# Altium schematic sheet voidFRL.SchDoc
size 558 x 431 mm
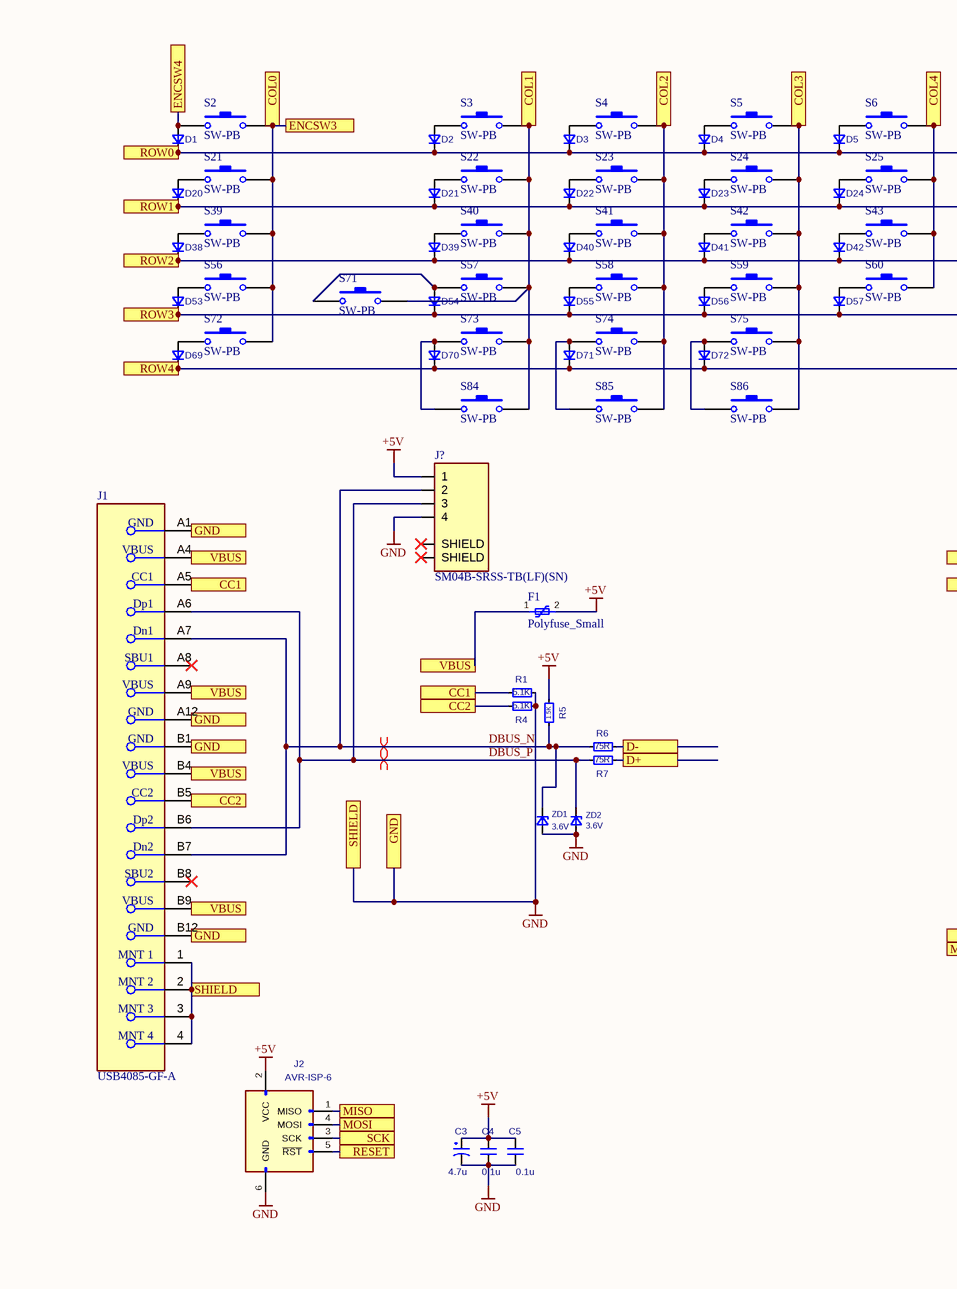
[diagram p0: voidFRL.SchDoc, left]
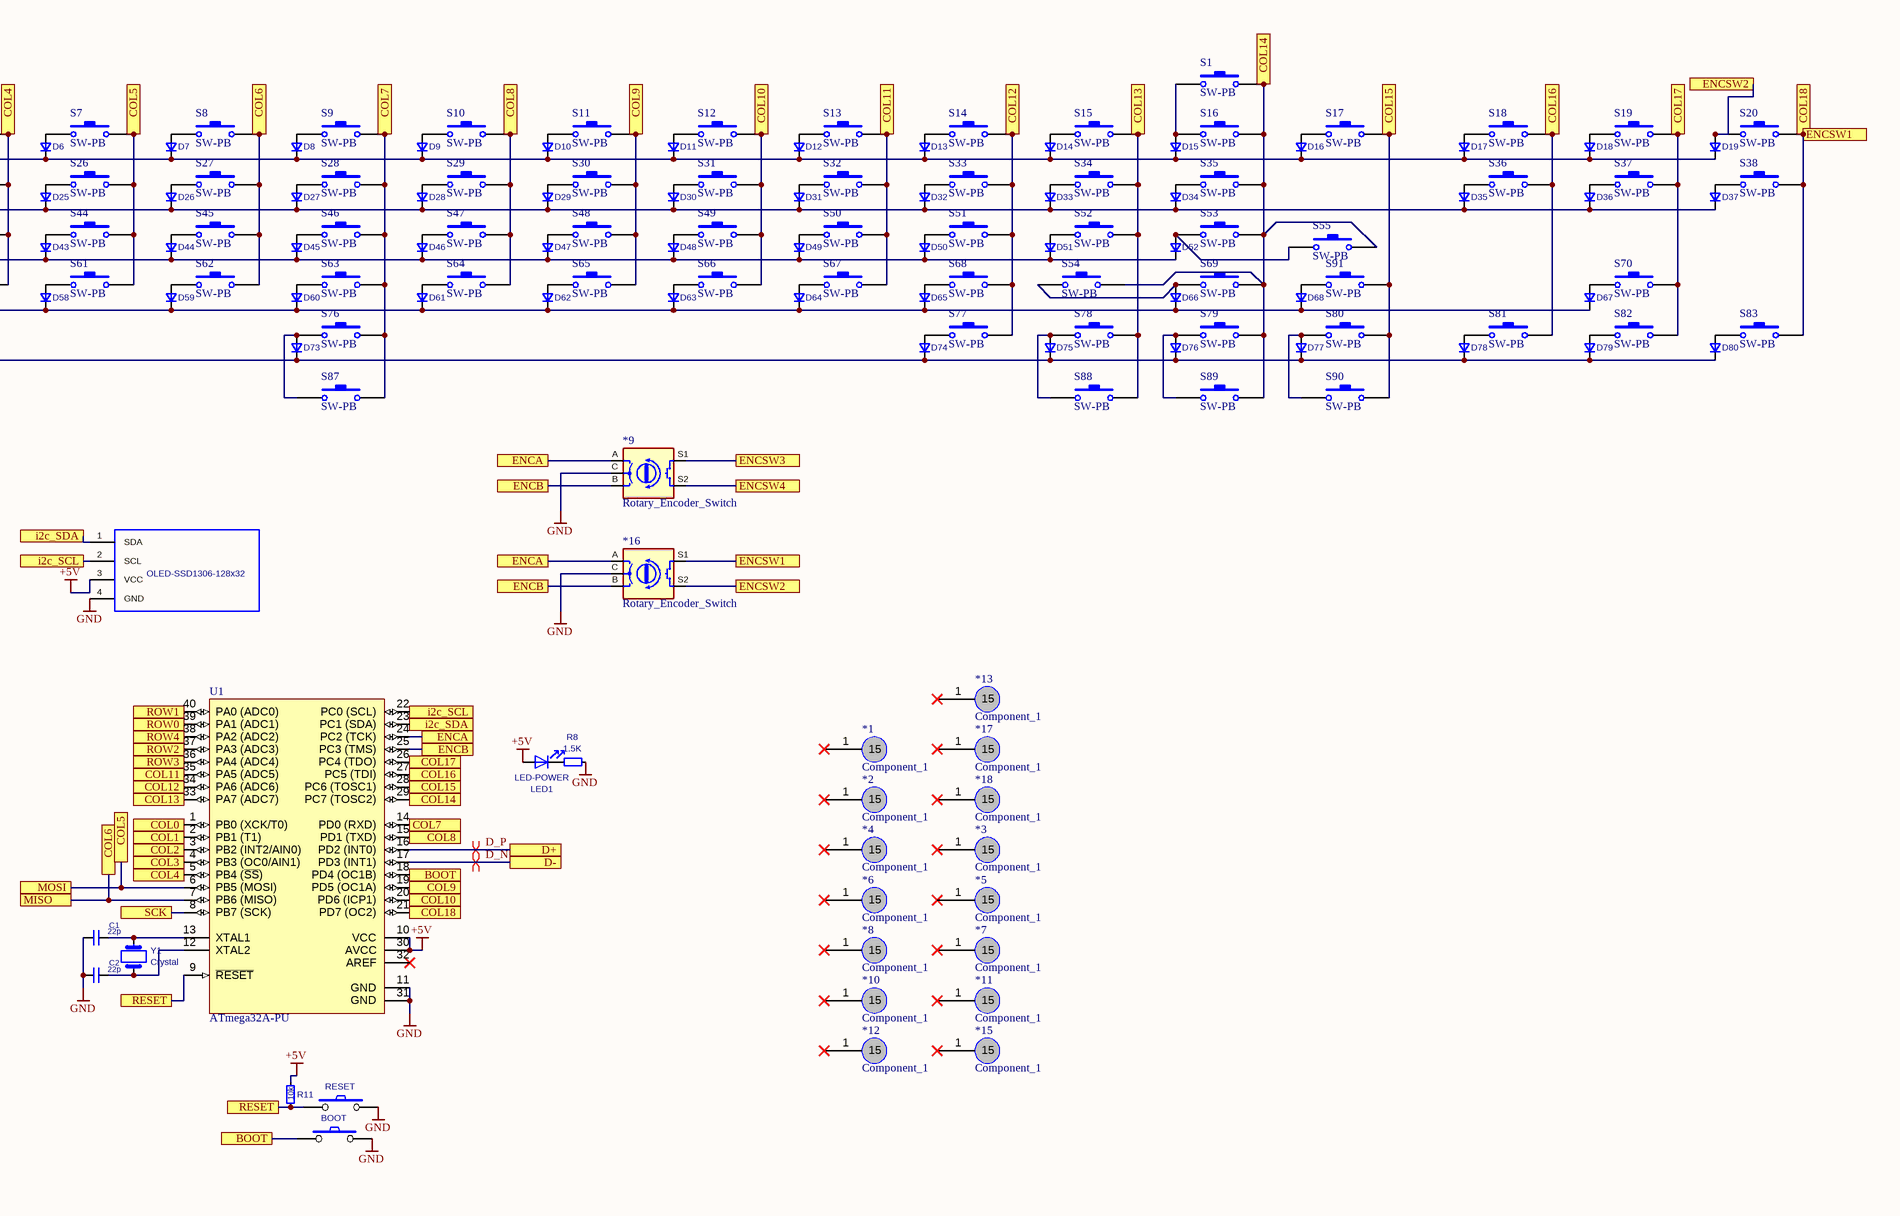
[diagram p1: voidFRL.SchDoc, right]

## Parts
*1  Component_1  [M2_Mounting_hole]
*2  Component_1  [M2_Mounting_hole]
*3  Component_1  [M2_Mounting_hole]
*4  Component_1  [M2_Mounting_hole]
*5  Component_1  [M2_Mounting_hole]
*6  Component_1  [M2_Mounting_hole]
*7  Component_1  [M2_Mounting_hole]
*8  Component_1  [M2_Mounting_hole]
*9  Rotary_Encoder_Switch  [RotaryEncoder_Alps_EC11E-Switch_Vertical_H20mm]
*10  Component_1  [M2_Mounting_hole]
*11  Component_1  [M2_Mounting_hole]
*12  Component_1  [M2_Mounting_hole]
*13  Component_1  [M2_Mounting_hole]
*15  Component_1  [M2_Mounting_hole]
*16  Rotary_Encoder_Switch  [RotaryEncoder_Alps_EC11E-Switch_Vertical_H20mm]
*17  Component_1  [M2_Mounting_hole]
*18  Component_1  [M2_Mounting_hole]
C1  22p  [C_Disc_D3.0mm_W1.6mm_P2.50mm]
C2  22p  [C_Disc_D3.0mm_W1.6mm_P2.50mm]
C3  4.7u  [CP_Radial_D4.0mm_P1.50mm]
C4  0.1u  [C_Disc_D4.3mm_W1.9mm_P5.00mm]
C5  0.1u  [C_Disc_D4.3mm_W1.9mm_P5.00mm]
D1  D_Small  [D_DO-35_SOD27_P5.08mm_Horizontal]  (value not drawn)
D2  D_Small  [D_DO-35_SOD27_P5.08mm_Horizontal]  (value not drawn)
D3  D_Small  [D_DO-35_SOD27_P5.08mm_Horizontal]  (value not drawn)
D4  D_Small  [D_DO-35_SOD27_P5.08mm_Horizontal]  (value not drawn)
D5  D_Small  [D_DO-35_SOD27_P5.08mm_Horizontal]  (value not drawn)
D6  D_Small  [D_DO-35_SOD27_P5.08mm_Horizontal]  (value not drawn)
D7  D_Small  [D_DO-35_SOD27_P5.08mm_Horizontal]  (value not drawn)
D8  D_Small  [D_DO-35_SOD27_P5.08mm_Horizontal]  (value not drawn)
D9  D_Small  [D_DO-35_SOD27_P5.08mm_Horizontal]  (value not drawn)
D10  D_Small  [D_DO-35_SOD27_P5.08mm_Horizontal]  (value not drawn)
D11  D_Small  [D_DO-35_SOD27_P5.08mm_Horizontal]  (value not drawn)
D12  D_Small  [D_DO-35_SOD27_P5.08mm_Horizontal]  (value not drawn)
D13  D_Small  [D_DO-35_SOD27_P5.08mm_Horizontal]  (value not drawn)
D14  D_Small  [D_DO-35_SOD27_P5.08mm_Horizontal]  (value not drawn)
D15  D_Small  [D_DO-35_SOD27_P5.08mm_Horizontal]  (value not drawn)
D16  D_Small  [D_DO-35_SOD27_P5.08mm_Horizontal]  (value not drawn)
D17  D_Small  [D_DO-35_SOD27_P5.08mm_Horizontal]  (value not drawn)
D18  D_Small  [D_DO-35_SOD27_P5.08mm_Horizontal]  (value not drawn)
D19  D_Small  [D_DO-35_SOD27_P5.08mm_Horizontal]  (value not drawn)
D20  D_Small  [D_DO-35_SOD27_P5.08mm_Horizontal]  (value not drawn)
D21  D_Small  [D_DO-35_SOD27_P5.08mm_Horizontal]  (value not drawn)
D22  D_Small  [D_DO-35_SOD27_P5.08mm_Horizontal]  (value not drawn)
D23  D_Small  [D_DO-35_SOD27_P5.08mm_Horizontal]  (value not drawn)
D24  D_Small  [D_DO-35_SOD27_P5.08mm_Horizontal]  (value not drawn)
D25  D_Small  [D_DO-35_SOD27_P5.08mm_Horizontal]  (value not drawn)
D26  D_Small  [D_DO-35_SOD27_P5.08mm_Horizontal]  (value not drawn)
D27  D_Small  [D_DO-35_SOD27_P5.08mm_Horizontal]  (value not drawn)
D28  D_Small  [D_DO-35_SOD27_P5.08mm_Horizontal]  (value not drawn)
D29  D_Small  [D_DO-35_SOD27_P5.08mm_Horizontal]  (value not drawn)
D30  D_Small  [D_DO-35_SOD27_P5.08mm_Horizontal]  (value not drawn)
D31  D_Small  [D_DO-35_SOD27_P5.08mm_Horizontal]  (value not drawn)
D32  D_Small  [D_DO-35_SOD27_P5.08mm_Horizontal]  (value not drawn)
D33  D_Small  [D_DO-35_SOD27_P5.08mm_Horizontal]  (value not drawn)
D34  D_Small  [D_DO-35_SOD27_P5.08mm_Horizontal]  (value not drawn)
D35  D_Small  [D_DO-35_SOD27_P5.08mm_Horizontal]  (value not drawn)
D36  D_Small  [D_DO-35_SOD27_P5.08mm_Horizontal]  (value not drawn)
D37  D_Small  [D_DO-35_SOD27_P5.08mm_Horizontal]  (value not drawn)
D38  D_Small  [D_DO-35_SOD27_P5.08mm_Horizontal]  (value not drawn)
D39  D_Small  [D_DO-35_SOD27_P5.08mm_Horizontal]  (value not drawn)
D40  D_Small  [D_DO-35_SOD27_P5.08mm_Horizontal]  (value not drawn)
D41  D_Small  [D_DO-35_SOD27_P5.08mm_Horizontal]  (value not drawn)
D42  D_Small  [D_DO-35_SOD27_P5.08mm_Horizontal]  (value not drawn)
D43  D_Small  [D_DO-35_SOD27_P5.08mm_Horizontal]  (value not drawn)
D44  D_Small  [D_DO-35_SOD27_P5.08mm_Horizontal]  (value not drawn)
D45  D_Small  [D_DO-35_SOD27_P5.08mm_Horizontal]  (value not drawn)
D46  D_Small  [D_DO-35_SOD27_P5.08mm_Horizontal]  (value not drawn)
D47  D_Small  [D_DO-35_SOD27_P5.08mm_Horizontal]  (value not drawn)
D48  D_Small  [D_DO-35_SOD27_P5.08mm_Horizontal]  (value not drawn)
D49  D_Small  [D_DO-35_SOD27_P5.08mm_Horizontal]  (value not drawn)
D50  D_Small  [D_DO-35_SOD27_P5.08mm_Horizontal]  (value not drawn)
D51  D_Small  [D_DO-35_SOD27_P5.08mm_Horizontal]  (value not drawn)
D52  D_Small  [D_DO-35_SOD27_P5.08mm_Horizontal]  (value not drawn)
D53  D_Small  [D_DO-35_SOD27_P5.08mm_Horizontal]  (value not drawn)
D54  D_Small  [D_DO-35_SOD27_P5.08mm_Horizontal]  (value not drawn)
D55  D_Small  [D_DO-35_SOD27_P5.08mm_Horizontal]  (value not drawn)
D56  D_Small  [D_DO-35_SOD27_P5.08mm_Horizontal]  (value not drawn)
D57  D_Small  [D_DO-35_SOD27_P5.08mm_Horizontal]  (value not drawn)
D58  D_Small  [D_DO-35_SOD27_P5.08mm_Horizontal]  (value not drawn)
D59  D_Small  [D_DO-35_SOD27_P5.08mm_Horizontal]  (value not drawn)
D60  D_Small  [D_DO-35_SOD27_P5.08mm_Horizontal]  (value not drawn)
D61  D_Small  [D_DO-35_SOD27_P5.08mm_Horizontal]  (value not drawn)
D62  D_Small  [D_DO-35_SOD27_P5.08mm_Horizontal]  (value not drawn)
D63  D_Small  [D_DO-35_SOD27_P5.08mm_Horizontal]  (value not drawn)
D64  D_Small  [D_DO-35_SOD27_P5.08mm_Horizontal]  (value not drawn)
D65  D_Small  [D_DO-35_SOD27_P5.08mm_Horizontal]  (value not drawn)
D66  D_Small  [D_DO-35_SOD27_P5.08mm_Horizontal]  (value not drawn)
D67  D_Small  [D_DO-35_SOD27_P5.08mm_Horizontal]  (value not drawn)
D68  D_Small  [D_DO-35_SOD27_P5.08mm_Horizontal]  (value not drawn)
D69  D_Small  [D_DO-35_SOD27_P5.08mm_Horizontal]  (value not drawn)
D70  D_Small  [D_DO-35_SOD27_P5.08mm_Horizontal]  (value not drawn)
D71  D_Small  [D_DO-35_SOD27_P5.08mm_Horizontal]  (value not drawn)
D72  D_Small  [D_DO-35_SOD27_P5.08mm_Horizontal]  (value not drawn)
D73  D_Small  [D_DO-35_SOD27_P5.08mm_Horizontal]  (value not drawn)
D74  D_Small  [D_DO-35_SOD27_P5.08mm_Horizontal]  (value not drawn)
D75  D_Small  [D_DO-35_SOD27_P5.08mm_Horizontal]  (value not drawn)
D76  D_Small  [D_DO-35_SOD27_P5.08mm_Horizontal]  (value not drawn)
D77  D_Small  [D_DO-35_SOD27_P5.08mm_Horizontal]  (value not drawn)
D78  D_Small  [D_DO-35_SOD27_P5.08mm_Horizontal]  (value not drawn)
D79  D_Small  [D_DO-35_SOD27_P5.08mm_Horizontal]  (value not drawn)
D80  D_Small  [D_DO-35_SOD27_P5.08mm_Horizontal]  (value not drawn)
F1  Polyfuse_Small  [polyfuse_5.1mm]
J1  USB4085-GF-A  [FP-USB4085-GF-A-MFG]
J2  AVR-ISP-6  [AVR_ICSP_3x2]
J?  SM04B-SRSS-TB(LF)(SN)  [JST_SM04B-SRSS-TB(LF)(SN)]
LED1  value LED-POWER  [LED_D3.0mm]  (hidden comment: LED-CPSLK)
OLED-1  OLED-SSD1306-128x32  [ssd1306 128x32 oled]
R1  5.1K  [R_Axial_DIN0204_L3.6mm_D1.6mm_P7.62mm_Horizontal]
R4  5.1K  [R_Axial_DIN0204_L3.6mm_D1.6mm_P7.62mm_Horizontal]
R5  1.5K  [R_Axial_DIN0204_L3.6mm_D1.6mm_P7.62mm_Horizontal]
R6  75R  [R_Axial_DIN0204_L3.6mm_D1.6mm_P7.62mm_Horizontal]
R7  75R  [R_Axial_DIN0204_L3.6mm_D1.6mm_P7.62mm_Horizontal]
R8  1.5K  [R_Axial_DIN0204_L3.6mm_D1.6mm_P7.62mm_Horizontal]
R11  10k  [R_Axial_DIN0204_L3.6mm_D1.6mm_P7.62mm_Horizontal]
RESET1  RESET  [SW_PUSH_6mm]
S1  SW-PB  [MX-switch - backspace]
S2  SW-PB  [MX-switch]
S3  SW-PB  [MX-switch]
S4  SW-PB  [MX-switch]
S5  SW-PB  [MX-switch]
S6  SW-PB  [MX-switch]
S7  SW-PB  [MX-switch]
S8  SW-PB  [MX-switch]
S9  SW-PB  [MX-switch]
S10  SW-PB  [MX-switch]
S11  SW-PB  [MX-switch]
S12  SW-PB  [MX-switch]
S13  SW-PB  [MX-switch]
S14  SW-PB  [MX-switch]
S15  SW-PB  [MX-switch]
S16  SW-PB  [MX-switch]
S17  SW-PB  [MX-switch]
S18  SW-PB  [MX-switch]
S19  SW-PB  [MX-switch]
S20  SW-PB  [MX-switch]
S21  SW-PB  [MX-switch]
S22  SW-PB  [MX-switch]
S23  SW-PB  [MX-switch]
S24  SW-PB  [MX-switch]
S25  SW-PB  [MX-switch]
S26  SW-PB  [MX-switch]
S27  SW-PB  [MX-switch]
S28  SW-PB  [MX-switch]
S29  SW-PB  [MX-switch]
S30  SW-PB  [MX-switch]
S31  SW-PB  [MX-switch]
S32  SW-PB  [MX-switch]
S33  SW-PB  [MX-switch]
S34  SW-PB  [MX-switch]
S35  SW-PB  [MX-switch]
S36  SW-PB  [MX-switch]
S37  SW-PB  [MX-switch]
S38  SW-PB  [MX-switch]
S39  SW-PB  [MX-switch]
S40  SW-PB  [MX-switch - CAPS]
S41  SW-PB  [MX-switch]
S42  SW-PB  [MX-switch]
S43  SW-PB  [MX-switch]
S44  SW-PB  [MX-switch]
S45  SW-PB  [MX-switch]
S46  SW-PB  [MX-switch]
S47  SW-PB  [MX-switch]
S48  SW-PB  [MX-switch]
S49  SW-PB  [MX-switch]
S50  SW-PB  [MX-switch]
S51  SW-PB  [MX-switch]
S52  SW-PB  [MX-switch]
S53  SW-PB  [MX-switch - ENTER_ANSI - ROTATED STAB]
S54  SW-PB  [MX-switch - 1.75]
S55  SW-PB  [MX-switch - PIPE_ISO_ENTER]
S56  SW-PB  [MX-switch]
S57  SW-PB  [MX-switch - 2.25U]
S58  SW-PB  [MX-switch]
S59  SW-PB  [MX-switch]
S60  SW-PB  [MX-switch]
S61  SW-PB  [MX-switch]
S62  SW-PB  [MX-switch]
S63  SW-PB  [MX-switch]
S64  SW-PB  [MX-switch]
S65  SW-PB  [MX-switch]
S66  SW-PB  [MX-switch]
S67  SW-PB  [MX-switch]
S68  SW-PB  [MX-switch]
S69  SW-PB  [MX-switch - 2.75U]
S70  SW-PB  [MX-switch]
S71  SW-PB  [MX-switch - 1.25U]
S72  SW-PB  [MX-switch]
S73  SW-PB  [MX-switch - 1.25U]
S74  SW-PB  [MX-switch - 1.25U]
S75  SW-PB  [MX-switch - 1.25U]
S76  SW-PB  [MX-switch - 6.25u space]
S77  SW-PB  [MX-switch - 1.25U]
S78  SW-PB  [MX-switch - 1.25U]
S79  SW-PB  [MX-switch - 1.25U]
S80  SW-PB  [MX-switch - 1.25U]
S81  SW-PB  [MX-switch]
S82  SW-PB  [MX-switch]
S83  SW-PB  [MX-switch]
S84  SW-PB  [MX-switch - 1.5U]
S85  SW-PB  [MX-switch]
S86  SW-PB  [MX-switch - 1.5U]
S87  SW-PB  [MX-switch - 7u space]
S88  SW-PB  [MX-switch - 1.5U]
S89  SW-PB  [MX-switch]
S90  SW-PB  [MX-switch - 1.5U]
S91  SW-PB  [MX-switch]
SW1  BOOT  [SW_PUSH_6mm]
U1  ATmega32A-PU  [40P6]
Y1  Crystal  [Crystal_HC49-4H_Vertical]
ZD1  3.6V  [D_DO-35_SOD27_P5.08mm_Horizontal]
ZD2  3.6V  [D_DO-35_SOD27_P5.08mm_Horizontal]

## Ports
BOOT, CC1, CC2, COL0, COL1, COL2, COL3, COL4, COL5, COL6, COL7, COL8, COL9, COL10, COL11, COL12, COL13, COL14, COL15, COL16, COL17, COL18, D+, D-, ENCA, ENCB, ENCSW1, ENCSW2, ENCSW3, ENCSW4, GND, i2c_SCL, i2c_SDA, MISO, MOSI, RESET, ROW0, ROW1, ROW2, ROW3, ROW4, SCK, SHIELD, VBUS

## Nets
+5V: C3.1 C4.1 C5.1 F1.2 J2.2(VCC) J?.1 LED1.2(A) OLED-1.3(VCC) R5.1 R11.1 U1.10(VCC) U1.30(AVCC)
GND: *9.C *16.C C1.2 C2.2 C3.2 C4.2 C5.2 J1.1(MNT_1) J1.2(MNT_2) J1.3(MNT_3) J1.4(MNT_4) J1.A1(GND) J1.A12(GND) J1.B1(GND) J1.B12(GND) J2.6(GND) J?.4 OLED-1.4(GND) R1.1 R4.2 R8.1 RESET1.2 SW1.2 U1.11(GND) U1.31(GND) ZD1.2(A) ZD2.2(A) ; port GND, port SHIELD
BOOT: SW1.1 U1.18(PD4_(OC1B)) ; port BOOT
CC1: J1.A5(CC1) R1.2 ; port CC1
CC2: J1.B5(CC2) R4.1 ; port CC2
COL0: *9.S1 S2.2 S21.2 S39.2 S56.2 S72.2 U1.1(PB0_(XCK/T0)) ; port COL0, port ENCSW3
COL1: S3.2 S22.2 S40.2 S57.2 S71.2 S73.2 S84.2 U1.2(PB1_(T1)) ; port COL1
COL2: S4.2 S23.2 S41.2 S58.2 S74.2 S85.2 U1.3(PB2_(INT2/AIN0)) ; port COL2
COL3: S5.2 S24.2 S42.2 S59.2 S75.2 S86.2 U1.4(PB3_(OC0/AIN1)) ; port COL3
COL4: S6.2 S25.2 S43.2 S60.2 U1.5(PB4_(~{SS})) ; port COL4
COL5: J2.4(MOSI) S7.2 S26.2 S44.2 S61.2 U1.6(PB5_(MOSI)) ; port MOSI, port COL5
COL6: J2.1(MISO) S8.2 S27.2 S45.2 S62.2 U1.7(PB6_(MISO)) ; port MISO, port COL6
COL7: S9.2 S28.2 S46.2 S63.2 S76.2 S87.2 U1.14(PD0_(RXD)) ; port COL7
COL8: S10.2 S29.2 S47.2 S64.2 U1.15(PD1_(TXD)) ; port COL8
COL9: S11.2 S30.2 S48.2 S65.2 U1.19(PD5_(OC1A)) ; port COL9
COL10: S12.2 S31.2 S49.2 S66.2 U1.20(PD6_(ICP1)) ; port COL10
COL11: S13.2 S32.2 S50.2 S67.2 U1.35(PA5_(ADC5)) ; port COL11
COL12: S14.2 S33.2 S51.2 S68.2 S77.2 U1.34(PA6_(ADC6)) ; port COL12
COL13: S15.2 S34.2 S52.2 S78.2 S88.2 U1.33(PA7_(ADC7)) ; port COL13
COL14: S1.2 S16.2 S35.2 S53.2 S54.2 S55.2 S69.2 S79.2 S89.2 U1.29(PC7_(TOSC2)) ; port COL14
COL15: S17.2 S80.2 S90.2 S91.2 U1.28(PC6_(TOSC1)) ; port COL15
COL16: S18.2 S36.2 S81.2 U1.27(PC5_(TDI)) ; port COL16
COL17: S19.2 S37.2 S70.2 S82.2 U1.26(PC4_(TDO)) ; port COL17
COL18: *16.S1 S20.2 S38.2 S83.2 U1.21(PD7_(OC2)) ; port ENCSW1, port COL18
D_N: R6.1 U1.17(PD3_(INT1)) ; port D-
D_P: R7.1 U1.16(PD2_(INT0)) ; port D+
DBUS_N: J1.A7(Dn1) J1.B7(Dn2) J?.2 R5.2 R6.2 ZD1.1(K)
DBUS_P: J1.A6(Dp1) J1.B6(Dp2) J?.3 R7.2 ZD2.1(K)
ENCA: *9.A *16.A U1.24(PC2_(TCK)) ; port ENCA
ENCB: *9.B *16.B U1.25(PC3_(TMS)) ; port ENCB
ENCSW2: *16.S2 D19.2(A) S20.1 ; port ENCSW2
ENCSW4: *9.S2 D1.2(A) S2.1 ; port ENCSW4
i2c_SCL: OLED-1.2(SCL) U1.22(PC0_(SCL)) ; port i2c_SCL
i2c_SDA: OLED-1.1(SDA) U1.23(PC1_(SDA)) ; port i2c_SDA
RESET: J2.5(~{RST}) R11.2 RESET1.1 U1.9(~{RESET}) ; port RESET
ROW0: D1.1(K) D2.1(K) D3.1(K) D4.1(K) D5.1(K) D6.1(K) D7.1(K) D8.1(K) D9.1(K) D10.1(K) D11.1(K) D12.1(K) D13.1(K) D14.1(K) D15.1(K) D16.1(K) D17.1(K) D18.1(K) D19.1(K) U1.39(PA1_(ADC1)) ; port ROW0
ROW1: D20.1(K) D21.1(K) D22.1(K) D23.1(K) D24.1(K) D25.1(K) D26.1(K) D27.1(K) D28.1(K) D29.1(K) D30.1(K) D31.1(K) D32.1(K) D33.1(K) D34.1(K) D35.1(K) D36.1(K) D37.1(K) U1.40(PA0_(ADC0)) ; port ROW1
ROW2: D38.1(K) D39.1(K) D40.1(K) D41.1(K) D42.1(K) D43.1(K) D44.1(K) D45.1(K) D46.1(K) D47.1(K) D48.1(K) D49.1(K) D50.1(K) D51.1(K) D52.1(K) U1.37(PA3_(ADC3)) ; port ROW2
ROW3: D53.1(K) D54.1(K) D55.1(K) D56.1(K) D57.1(K) D58.1(K) D59.1(K) D60.1(K) D61.1(K) D62.1(K) D63.1(K) D64.1(K) D65.1(K) D66.1(K) D67.1(K) D68.1(K) U1.36(PA4_(ADC4)) ; port ROW3
ROW4: D69.1(K) D70.1(K) D71.1(K) D72.1(K) D73.1(K) D74.1(K) D75.1(K) D76.1(K) D77.1(K) D78.1(K) D79.1(K) D80.1(K) U1.38(PA2_(ADC2)) ; port ROW4
SCK: J2.3(SCK) U1.8(PB7_(SCK)) ; port SCK
VBUS: F1.1 J1.A4(VBUS) J1.A9(VBUS) J1.B4(VBUS) J1.B9(VBUS) ; port VBUS
NetC1_1: C1.1 U1.13(XTAL1) Y1.1
NetC2_1: C2.1 U1.12(XTAL2) Y1.2
NetD2_2: D2.2(A) S3.1
NetD3_2: D3.2(A) S4.1
NetD4_2: D4.2(A) S5.1
NetD5_2: D5.2(A) S6.1
NetD6_2: D6.2(A) S7.1
NetD7_2: D7.2(A) S8.1
NetD8_2: D8.2(A) S9.1
NetD9_2: D9.2(A) S10.1
NetD10_2: D10.2(A) S11.1
NetD11_2: D11.2(A) S12.1
NetD12_2: D12.2(A) S13.1
NetD13_2: D13.2(A) S14.1
NetD14_2: D14.2(A) S15.1
NetD15_2: D15.2(A) S1.1 S16.1
NetD16_2: D16.2(A) S17.1
NetD17_2: D17.2(A) S18.1
NetD18_2: D18.2(A) S19.1
NetD20_2: D20.2(A) S21.1
NetD21_2: D21.2(A) S22.1
NetD22_2: D22.2(A) S23.1
NetD23_2: D23.2(A) S24.1
NetD24_2: D24.2(A) S25.1
NetD25_2: D25.2(A) S26.1
NetD26_2: D26.2(A) S27.1
NetD27_2: D27.2(A) S28.1
NetD28_2: D28.2(A) S29.1
NetD29_2: D29.2(A) S30.1
NetD30_2: D30.2(A) S31.1
NetD31_2: D31.2(A) S32.1
NetD32_2: D32.2(A) S33.1
NetD33_2: D33.2(A) S34.1
NetD34_2: D34.2(A) S35.1
NetD35_2: D35.2(A) S36.1
NetD36_2: D36.2(A) S37.1
NetD37_2: D37.2(A) S38.1
NetD38_2: D38.2(A) S39.1
NetD39_2: D39.2(A) S40.1
NetD40_2: D40.2(A) S41.1
NetD41_2: D41.2(A) S42.1
NetD42_2: D42.2(A) S43.1
NetD43_2: D43.2(A) S44.1
NetD44_2: D44.2(A) S45.1
NetD45_2: D45.2(A) S46.1
NetD46_2: D46.2(A) S47.1
NetD47_2: D47.2(A) S48.1
NetD48_2: D48.2(A) S49.1
NetD49_2: D49.2(A) S50.1
NetD50_2: D50.2(A) S51.1
NetD51_2: D51.2(A) S52.1
NetD52_2: D52.2(A) S53.1 S55.1
NetD53_2: D53.2(A) S56.1
NetD54_2: D54.2(A) S57.1 S71.1
NetD55_2: D55.2(A) S58.1
NetD56_2: D56.2(A) S59.1
NetD57_2: D57.2(A) S60.1
NetD58_2: D58.2(A) S61.1
NetD59_2: D59.2(A) S62.1
NetD60_2: D60.2(A) S63.1
NetD61_2: D61.2(A) S64.1
NetD62_2: D62.2(A) S65.1
NetD63_2: D63.2(A) S66.1
NetD64_2: D64.2(A) S67.1
NetD65_2: D65.2(A) S68.1
NetD66_2: D66.2(A) S54.1 S69.1
NetD67_2: D67.2(A) S70.1
NetD68_2: D68.2(A) S91.1
NetD69_2: D69.2(A) S72.1
NetD70_2: D70.2(A) S73.1 S84.1
NetD71_2: D71.2(A) S74.1 S85.1
NetD72_2: D72.2(A) S75.1 S86.1
NetD73_2: D73.2(A) S76.1 S87.1
NetD74_2: D74.2(A) S77.1
NetD75_2: D75.2(A) S78.1 S88.1
NetD76_2: D76.2(A) S79.1 S89.1
NetD77_2: D77.2(A) S80.1 S90.1
NetD78_2: D78.2(A) S81.1
NetD79_2: D79.2(A) S82.1
NetD80_2: D80.2(A) S83.1
NetLED1_1: LED1.1(K) R8.2

Not connected (* = marked no-connect by the designer): *1 1(15)*; *2 1(15)*; *3 1(15)*; *4 1(15)*; *5 1(15)*; *6 1(15)*; *7 1(15)*; *8 1(15)*; *10 1(15)*; *11 1(15)*; *12 1(15)*; *13 1(15)*; *15 1(15)*; *17 1(15)*; *18 1(15)*; J1 A8(SBU1)* B8(SBU2)*; J? S1(SHIELD)* S2(SHIELD)*; U1 32(AREF)*

## Layout directives
differential pair: D_N, D_P, DBUS_N, DBUS_P

## Notes on the sheet
- DWG. NO.
- REV.
- SHT.
- REVISION
- DESCRIPTION
- DATE
- APPROVED
- THIS DOCUMENT AND THE DATA DISCLOSED HEREIN OR HEREWITH IS THE PROPERTY OF ALTIUM LIMITED AND MAY BE FREELY DISTRIBUTED IN WHOLE. NO RIGHTS ARE RESERVED OR EXPRESS OR IMPLIED WARANTEE GIVEN.
- ENG:
- DSN:
- APPROVALS
- PROJECT
- DOCUMENT REVISION:
- DESIGN ITEM:
- CHK:
- BOM:
- REFERENCE DOCUMENTS
- PROJECT REVISION:
- TITLE
- FAB DWG:
- PCB DWG:
- ASSY DWG:
- SCALE:
- SIZE
- C
- CAGE CODE
- FILE NAME
- DWG NO.
- SHEET
- OF
- REV

## Library data of the parts
C1 C2 C4 C5 = C_Small
  C1 C2: Value: 22p; Footprint: cftkb:C_Disc_D3.0mm_W1.6mm_P2.50mm
  C4 C5: Value: 0.1u; Footprint: cftkb:C_Disc_D4.3mm_W1.9mm_P5.00mm
C3 = CP1_Small: Value: 4.7u; Footprint: cftkb:CP_Radial_D4.0mm_P1.50mm
J1 = CMP-196119-000001-1: CONN RCPT USB2.0 TYPEC 16POS; Manufacturer: Global Connector Technology; Voltage Rating: 20V; Conn Orientation: Right Angle; Shielding: true; Current Rating: 4.25A; Number Of Contacts: 16; Pitch: 0.85mm; Is Female: yes; ComponentLink2URL: https://gct.co/files/drawings/usb4085.pdf; Category: Conn; Automotive: No; ComponentLink2Description: Datasheet; Height: 3.66mm; Manufacturer Part Number: USB4085-GF-A; Package: 0; Usb Standard: USB 2.0; Octopart: https://octopart.com/usb4085-gf-a-global+connector+technology-94773699; Device Class L3: unset; Digikey Description: CONN RCPT USB2.0 TYPEC 16POS; Temperature Range Low: -40°C; Temperature: -40°C to +85°C; Lead Free: Yes; Contact Material: Gold,Nickel; Device Class L1: Connectors; Temperature Range High: +85°C; Device Class L2: USB Connectors; RoHS: TRUE
J2 = AVR-ISP-6-Connector: Value: AVR-ISP-6; Footprint: cftkb:AVR_ICSP_3x2
J? = SM04B-SRSS-TB(LF)(SN): Connector Header Surface Mount, Right Angle 4 position 0.039 _1.00mm_; MF: JST Sales; MP: SM04B-SRSS-TB_LF__SN_; Price: None; SnapEDA_Link: https://www.snapeda.com/parts/SM04B-SRSS-TB%28LF%29%28SN%29/JST%20Sales%20America%20Inc./view-part/557466/?ref=snap; Value: *; Availability: Unavailable; Package: None
LED1 = LED: Footprint: cftkb:LED_D3.0mm
OLED-1 = OLED: Value: OLED-SSD1306-128x32; Footprint: 3175x:ssd1306-128x32-oled
R1 R4-R8 R11 = R_Small: Footprint: cftkb:R_Axial_DIN0204_L3.6mm_D1.6mm_P7.62mm_Horizontal
  R1 R4: Value: 5.1K
  R5 R8: Value: 1.5K
  R6 R7: Value: 75R
  R11: Value: 10k
RESET1 SW1 = SW_PUSH: Footprint: cftkb:SW_PUSH_6mm
  RESET1: Value: RESET
  SW1: Value: BOOT
S1-S91 = SW-PB: Switch; Published: 24-Mar-1999; LatestRevisionDate: 17-Jul-2002; LatestRevisionNote: Re-released for DXP Platform.; PackageReference: SPST-2; Publisher: Altium Limited; PackageDescription: Switch; 2 Leads
U1 = CMP-0095-00028-2: 8-bit AVR Microcontroller, 2.7-5.5V, 16MHz, 32KB Flash, 1KB EEPROM, 2KB SRAM, 40-pin PDIP, Industrial Grade (-40°C to 85°C); Code_JEDEC: MS-011-AC; ComponentLink3Description: ATmega32A Summary; PackageVersion: revB, Sep-2001; ComponentLink2Description: ATmega32A Datasheet; ComponentLink3URL: http://www.atmel.com/dyn/resources/prod_documents/8155S.pdf; PackageDescription: 40-lead (0.600"/15.24mm Wide) Plastic Dual Inline Package (PDIP); ComponentLink1Description: Manufacturer URL; PackageReference: 40P6; DatasheetVersion: revC, Feb-2011; ComponentLink2URL: http://www.atmel.com/dyn/resources/prod_documents/doc8155.pdf; RevisionNote: DatasheetVersion updated. URLs added.; ComponentLink1URL: http://www.atmel.com/
ZD1 ZD2 = D_Zener_Small: Value: 3.6V; Footprint: cftkb:D_DO-35_SOD27_P5.08mm_Horizontal
D1-D80 = D_Small: Value: D_Small; Footprint: cftkb:D_DO-35_SOD27_P5.08mm_Horizontal
Y1 = Crystal: Value: Crystal; Footprint: cftkb:Crystal_HC49-4H_Vertical